# Altium schematic sheet can.SchDoc: CAN Bus
size A4; DocumentNumber: 5; SheetNumber: 5; SheetTotal: 8
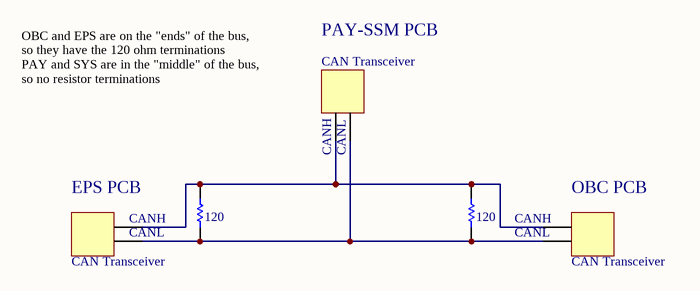
[diagram p0: can.SchDoc]

## Parts
(Parts that share a designator on the sheet are numbered #1, #2 ... from top to bottom, then left to right.)
P?#1  CAN Transceiver  [HDR1X2]
P?#2  CAN Transceiver  [HDR1X2]
P?#3  CAN Transceiver  [HDR1X2]
R?#1  value 120  [AXIAL-0.3]  (hidden comment: Res1)
R?#2  value 120  [AXIAL-0.3]  (hidden comment: Res1)

## Nets
NetP?#1_1: P?#1.1 P?#2.1 P?#3.2 R?#1.1 R?#2.2
NetP?#1_2: P?#1.2 P?#2.2 P?#3.1 R?#1.2 R?#2.1

## Notes on the sheet
- PAY-SSM PCB
- OBC and EPS are on the "ends" of the bus, so they have the 120 ohm terminations
  PAY and SYS are in the "middle" of the bus, so no resistor terminations
- (near P?#3) EPS PCB
- (near P?#1) CANH
- (near P?#1) CANL
- (near P?#2) OBC PCB
- (near P?#3) CANH
- (near P?#3) CANL
- CANH
- CANL

## Library data of the parts
P?#1-P?#3 = Header 2: Header, 2-Pin; LatestRevisionDate: 17-Jul-2002; LatestRevisionNote: Re-released for DXP Platform.; Publisher: Altium Limited
R?#1 R?#2 = Res1: Resistor; Published: 8-Jun-2000; LatestRevisionDate: 17-Jul-2002; LatestRevisionNote: Re-released for DXP Platform.; PackageReference: AXIAL-0.3; Publisher: Altium Limited; PackageDescription: Axial Device, Thru-Hole; 2 Leads; 0.3 in Pin Spacing